# EasyEDA schematic OpenRuchePCB.json
TITLE: Sheet_1; REV: 1.0; Date: 2021-11-24; Sheet: 1/1; Drawn By: Leo.Delas; Company: Your Company
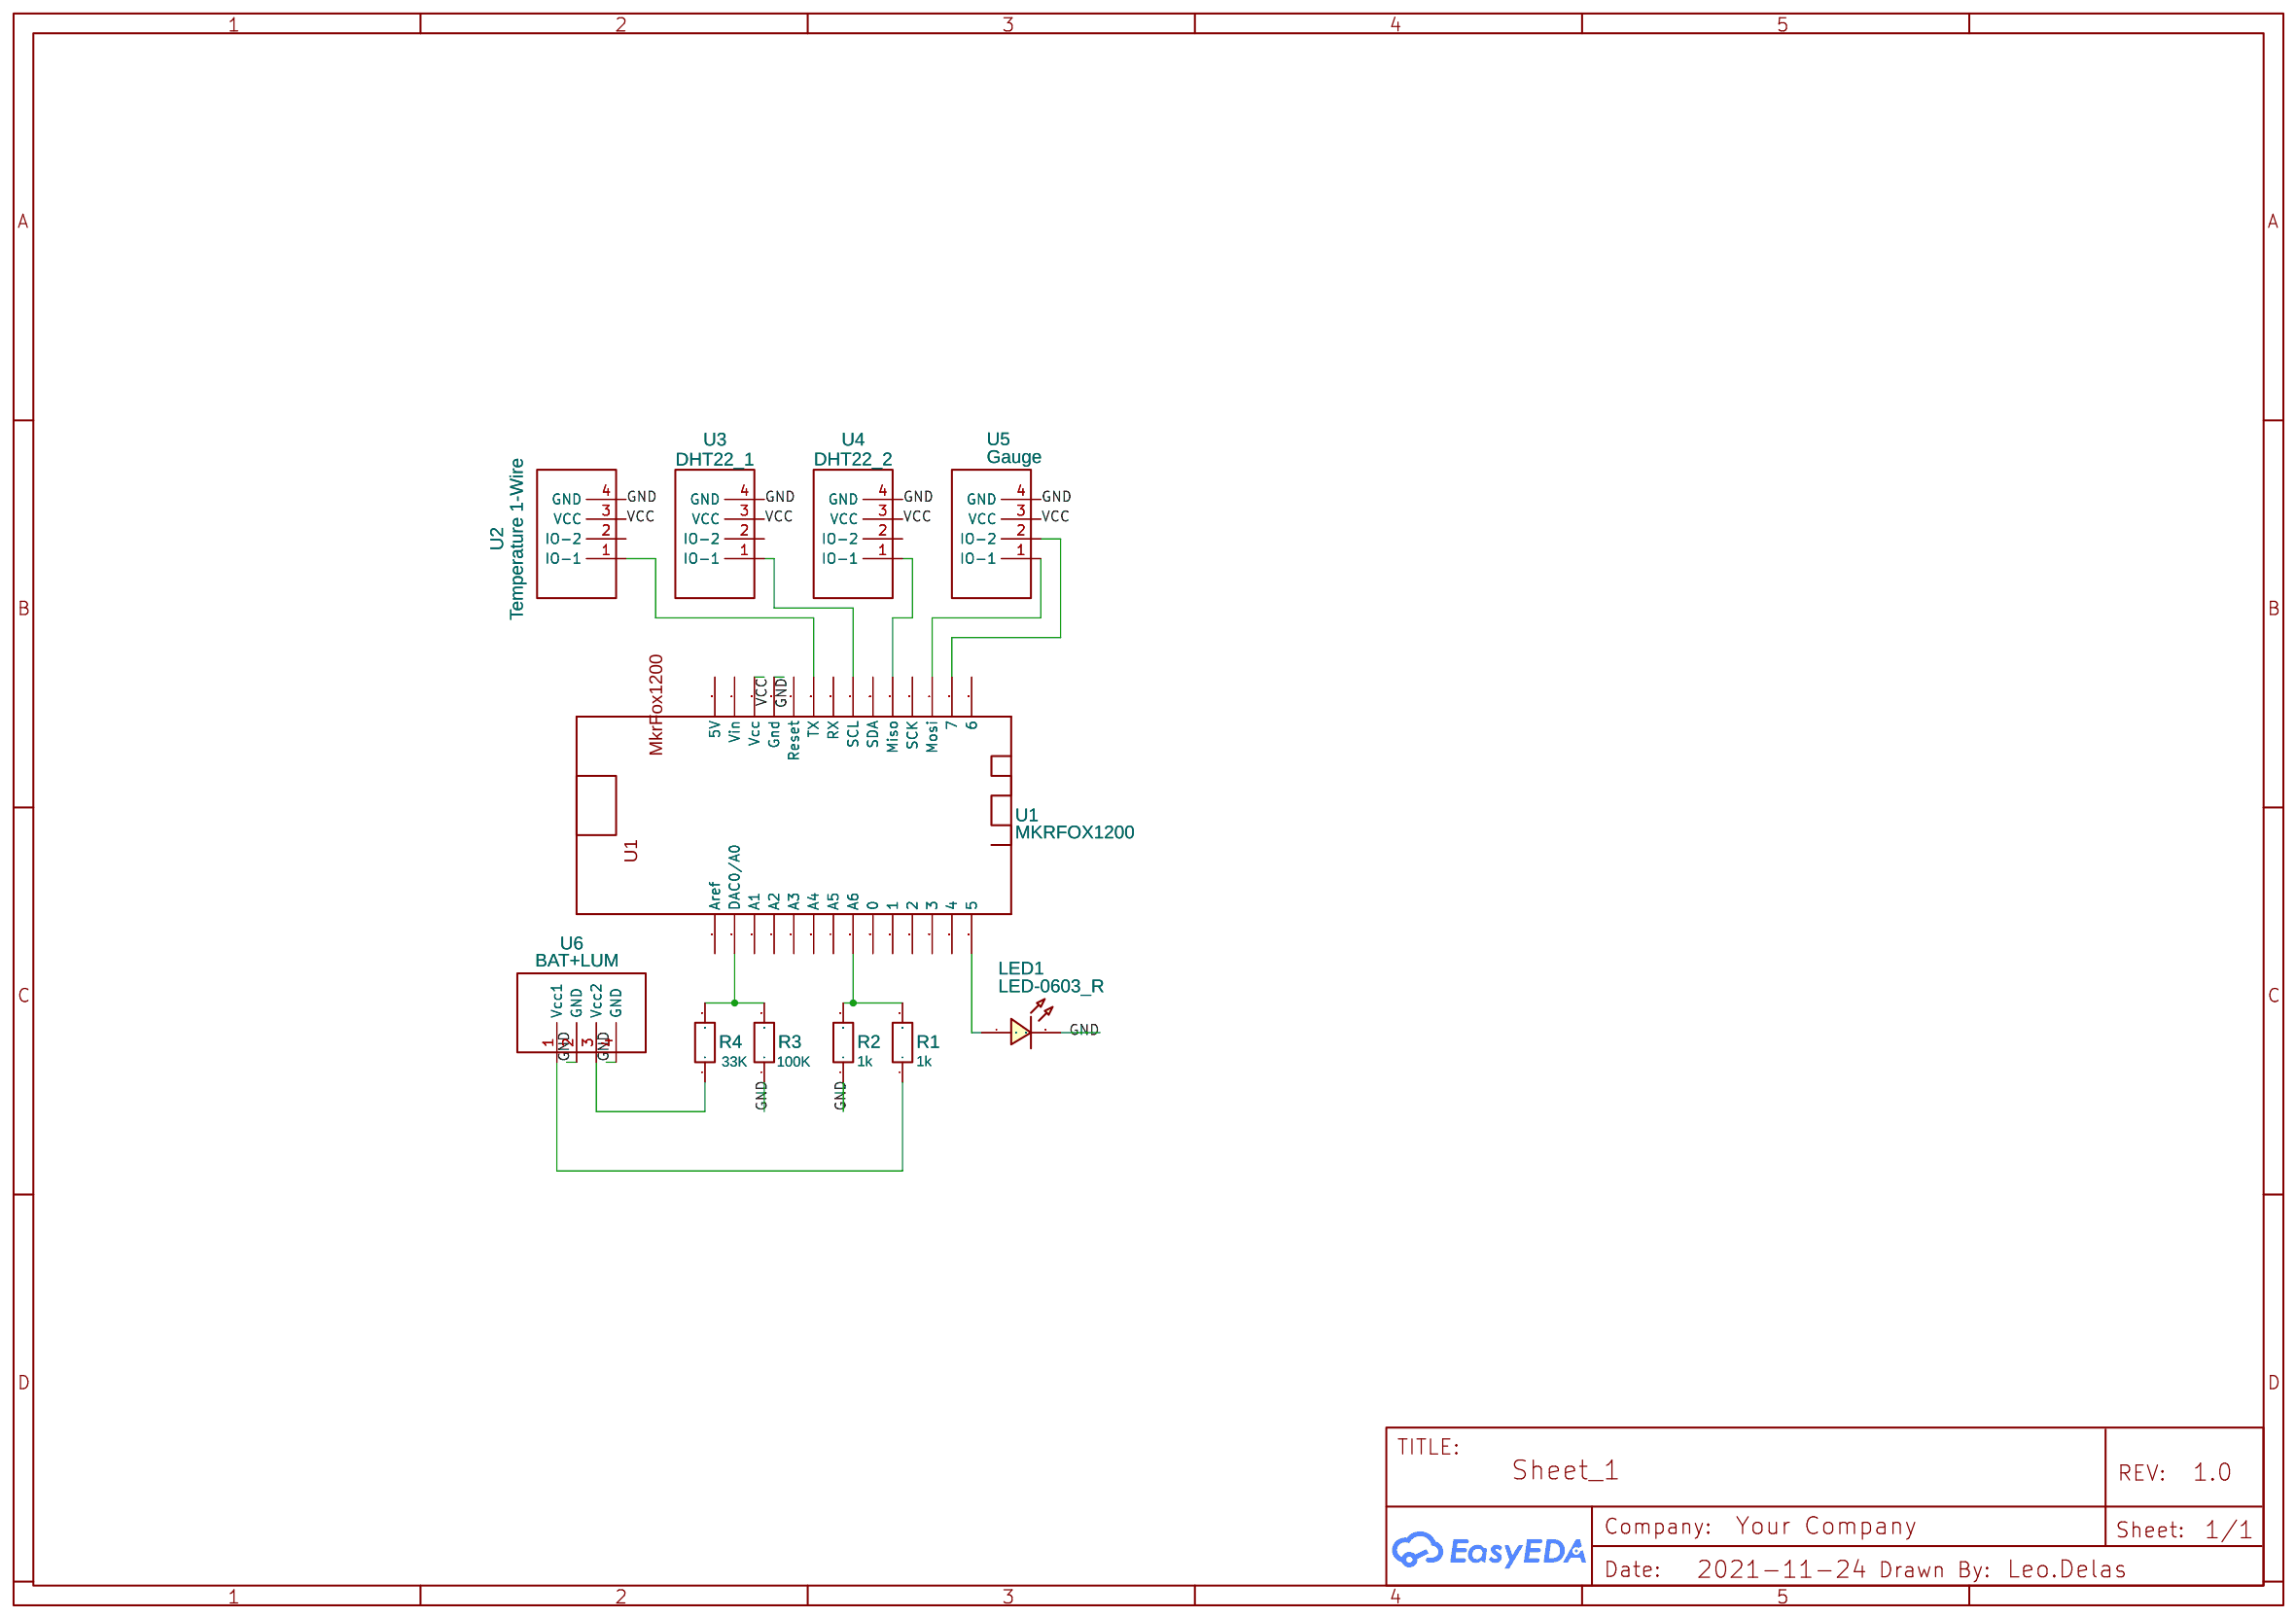
[diagram p0: schematic sheet]

## Parts
LED1  LED-0603_R  [LED0603_RED]
R1  1k  [R0603]
R2  1k  [R0603]
R3  100K  [R0603]
R4  33K  [R0603]
U1  MKRFOX1200  [PCHATILL_MKRFOX1200_2]
U2  Temperature 1-Wire  [GROVE_1X04]
U3  DHT22_1  [GROVE_1X04]
U4  DHT22_2  [GROVE_1X04]
U5  Gauge  [GROVE_1X04]
U6  BAT+LUM  [GROVE_1X04]

## Library data of the parts
LED1 = LED-0603_R: Manufacturer: EVERLIGHT(台湾亿光); Manufacturer Part: 19-217/R6C-AL1M2VY/3T; Supplier Part: C72044; Supplier: LCSC; Contributor: LCEDA_01
R1-R4 = R_0603_EU: Contributor: LCEDA_Lib
U1 = MKRFOX1200: Contributor: tylerpaul
U2-U6 = Grove - GPIO: sourceId: ce82jBTN5; Supplier Part: undefined; Supplier: SeeedStudio; Contributor: jonchandler

## Nets
GND: LED1.2 R2.1 R3.1 U1.25(Gnd) U2.4(GND) U3.4(GND) U4.4(GND) U5.4(GND) U6.2(GND) U6.4(GND)
VCC: U1.26(Vcc) U2.3(VCC) U3.3(VCC) U4.3(VCC) U5.3(VCC)
Net-(LED1-1): LED1.1 U1.14(5)
Net-(R1-1): R1.1 U6.1(Vcc1)
Net-(R1-2): R1.2 R2.2 U1.8(A6)
Net-(R3-2): R3.2 R4.2 U1.2(DAC0/A0)
Net-(R4-1): R4.1 U6.3(Vcc2)
Net-(U1-16): U1.16(7) U5.2(IO-2)
Net-(U1-17): U1.17(Mosi) U5.1(IO-1)
Net-(U1-19): U1.19(Miso) U4.1(IO-1)
Net-(U1-21): U1.21(SCL) U3.1(IO-1)
Net-(U1-23): U1.23(TX) U2.1(IO-1)

Not connected (* = marked no-connect by the designer): U1 1(Aref) 3(A1) 4(A2) 5(A3) 6(A4) 7(A5) 9(0) 10(1) 11(2) 12(3) 13(4) 15(6) 18(SCK) 20(SDA) 22(RX) 24(Reset) 27(Vin) 28(5V); U2 2(IO-2); U3 2(IO-2); U4 2(IO-2)
